# Altium project charger.PrjPCB
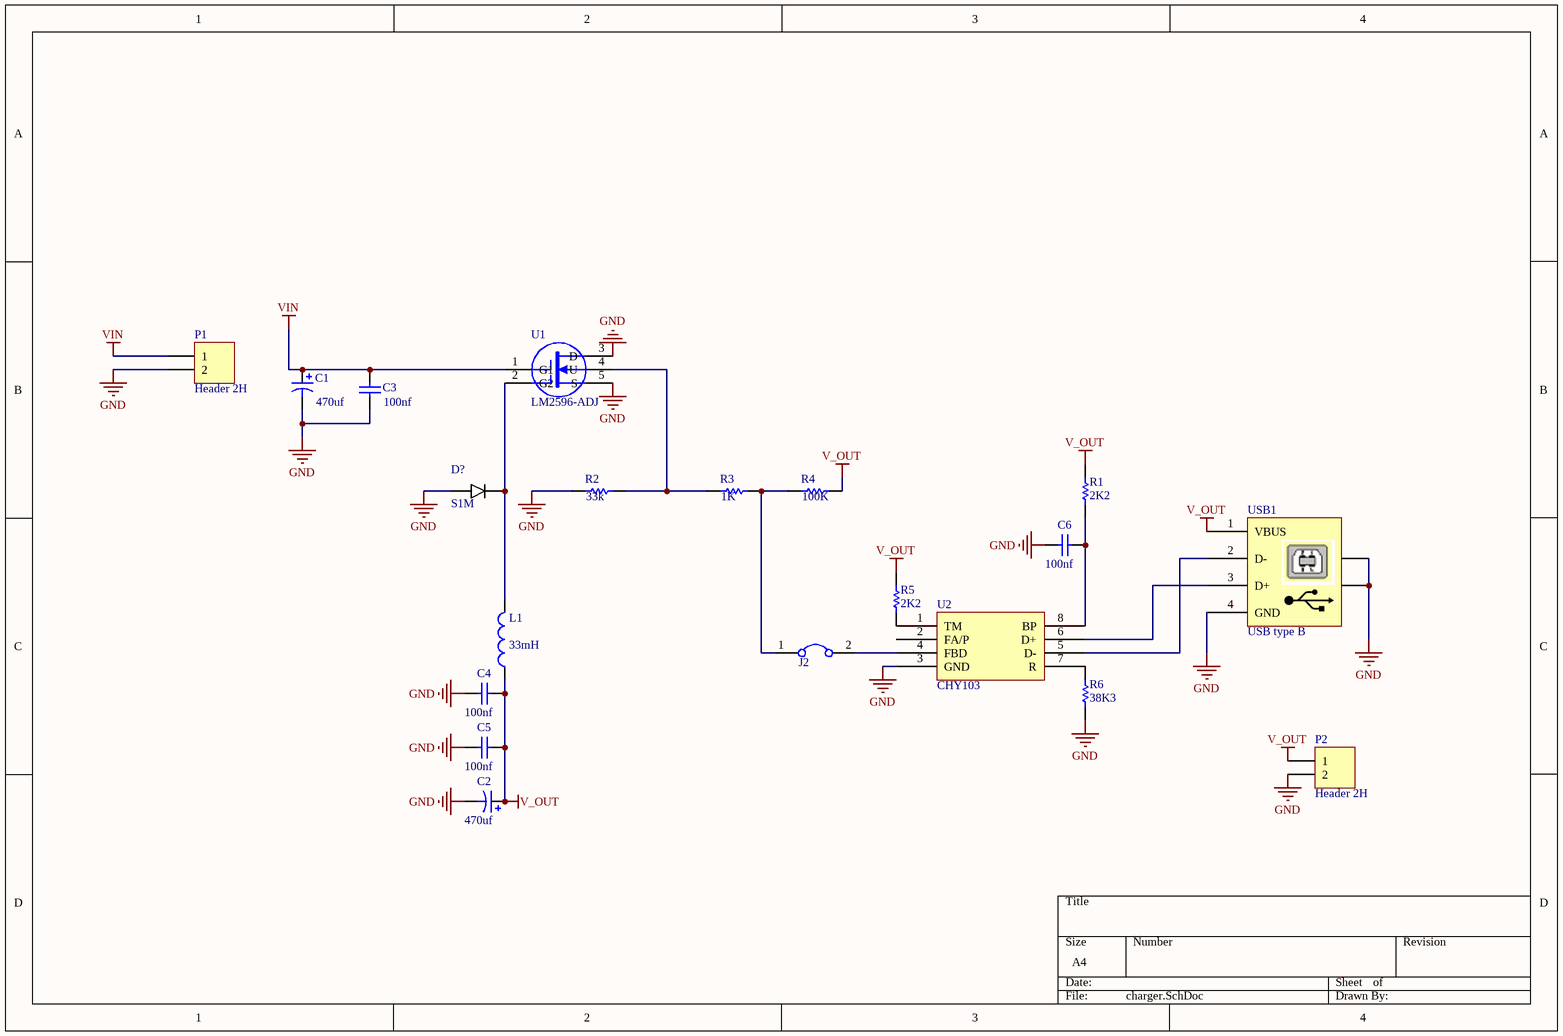
[diagram p0: charger.SchDoc]
1 sheet, 20 parts. Net scope: global (net labels, ports and power ports of the same name join across sheets).
Board file: chargerNewD.PcbDoc

## Sheet charger.SchDoc
size A4

### Parts
C1  value 470uf  [RB5-10.5]  (hidden comment: Cap Pol1)
C2  value 470uf  [RB5-10.5]  (hidden comment: Cap Pol1)
C3  value 100nf  [6-0805_L]  (hidden comment: Cap)
C4  value 100nf  [6-0805_L]  (hidden comment: Cap)
C5  value 100nf  [6-0805_L]  (hidden comment: Cap)
C6  value 100nf  [6-0805_L]  (hidden comment: Cap)
D?  S1M  [*DIOM5227X270N_S1M(Primary)]
J2  JUMPER  [HDR1X2]  (value not drawn)
L1  value 33mH  [IND_SMD-13.0mm]  (hidden comment: Inductor)
P1  Header 2H  [HDR1X2]
P2  Header 2H  [HDR1X2]
R1  value 2K2  [6-0805_L]  (hidden comment: Res1)
R2  value 33k  [6-0805_L]  (hidden comment: Res1)
R3  value 1K  [6-0805_L]  (hidden comment: Res1)
R4  value 100K  [6-0805_L]  (hidden comment: Res1)
R5  value 2K2  [6-0805_L]  (hidden comment: Res1)
R6  value 38K3  [6-0805_L]  (hidden comment: Res1)
U1  LM2596-ADJ  [T05A]
U2  CHY103  [8 pin SOIC_L]
USB1  USB Connector-B Type  [USB2.5-2H4C]  (value not drawn)

### Nets
GND: C1.2 C2.2 C3.1 C4.2 C5.2 C6.2 D?.A P1.2 P2.2 R2.1 R6.1 U1.3(D) U1.5(S) U2.3(GND) USB1.4(GND) USB1.5 USB1.6
V_OUT: C2.1 C4.1 C5.1 L1.1 P2.1 R1.2 R4.2 R5.2 USB1.1(VBUS)
VIN: C1.1 C3.2 P1.1 U1.1(G1)
NetC6_1: C6.1 R1.1 U2.8(BP)
NetD?_C: D?.C(K) L1.2 U1.2(G2)
NetJ2_1: J2.1 R3.2 R4.1
NetJ2_2: J2.2 U2.4(FBD)
NetR2_2: R2.2 R3.1 U1.4(U)
NetR5_1: R5.1 U2.1(TM)
NetR6_2: R6.2 U2.7(R)
NetU2_5: U2.5(D-) USB1.2(D-)
NetU2_6: U2.6(D+) USB1.3(D+)

Not connected (* = marked no-connect by the designer): U2 2(FA/P)

### Notes on the sheet
- (in symbol USB Connector-B Type) USB type B

### Library data of the parts
C1 C2 = Cap Pol1: Polarized Capacitor (Radial); Published: 8-Jun-2000; LatestRevisionDate: 17-Jul-2002; LatestRevisionNote: Re-released for DXP Platform.; PackageReference: RB7.6-15; Publisher: Altium Limited; PackageDescription: Polarized Capacitor (Radial); 2 Leads
C3-C6 = Cap: Capacitor; Published: 8-Jun-2000; LatestRevisionDate: 17-Jul-2002; LatestRevisionNote: Re-released for DXP Platform.; PackageReference: RAD-0.3; Publisher: Altium Limited; PackageDescription: Radial Cap, Thru-Hole; 2 Leads; 0.3 in Pin Spacing
D? = S1M: S1 Series 1000 V 1 A 1 uA Surface Mount General Purpose Rectifier - DO-214AC; MF: ON Semiconductor; Price: None; Availability: Unavailable; SnapEDA_Link: https://www.snapeda.com/parts/S1M/ON%20Semiconductor/view-part/?ref=snap; Package: DO-214AC-214 ON Semiconductor; MP: S1M; Value: *
L1 = Inductor: Code_IEC: 1005; Published: 8-Jun-2000; LatestRevisionDate: 29-May-2009; LatestRevisionNote: IPC-7351 Footprint Added.; PackageReference: 0402-A; Publisher: Altium Limited; PackageDescription: Chip Inductor; Code_JEITA: 0402
P1 P2 = Header 2H: Header, 2-Pin, Right Angle; LatestRevisionDate: 17-Jul-2002; LatestRevisionNote: Re-released for DXP Platform.; Publisher: Altium Limited
R1-R6 = Res1: Resistor; Published: 8-Jun-2000; LatestRevisionDate: 17-Jul-2002; LatestRevisionNote: Re-released for DXP Platform.; PackageReference: AXIAL-0.3; Publisher: Altium Limited; PackageDescription: Axial Device, Thru-Hole; 2 Leads; 0.3 in Pin Spacing
U1 = MOSFET-N3: Two-Gate, N-Channel MOSFET, Externally Terminated Substrate; Published: 24-Mar-1999; LatestRevisionDate: 17-Jul-2002; LatestRevisionNote: Re-released for DXP Platform.; PackageReference: T05A; Publisher: Altium Limited; PackageDescription: TO-220, Molded, 5 Lead, Straight; Code_JEDEC: TS-001-AA